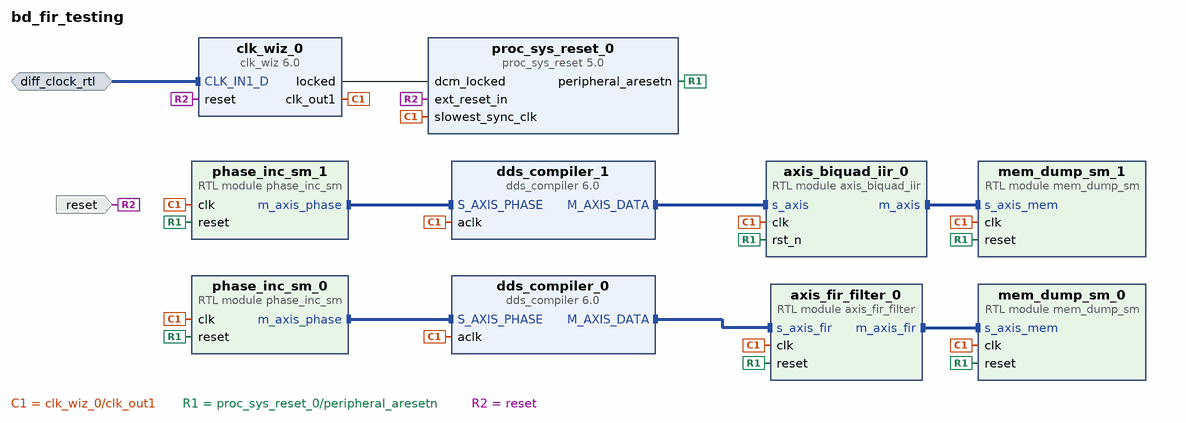
[diagram p0: block diagram of the top level]
# Vivado block design bd_fir_testing, xc7z010clg400-1, Vivado 2023.2
create_bd_design bd_fir_testing

create_bd_intf_port -mode Slave -vlnv xilinx.com:interface:diff_clock_rtl:1.0 diff_clock_rtl
set_property -dict {CONFIG.FREQ_HZ 100000000} [get_bd_intf_ports diff_clock_rtl]
create_bd_port -dir I -type rst reset
set_property -dict {CONFIG.POLARITY ACTIVE_HIGH} [get_bd_ports reset]

create_bd_cell -type ip -vlnv xilinx.com:ip:clk_wiz:6.0 clk_wiz_0
set_property -dict [list \
  CONFIG.CLKIN1_JITTER_PS 100.0 \
  CONFIG.CLKOUT1_JITTER 130.958 \
  CONFIG.CLKOUT1_PHASE_ERROR 98.575 \
  CONFIG.MMCM_CLKFBOUT_MULT_F 10.000 \
  CONFIG.MMCM_CLKIN1_PERIOD 10.000 \
  CONFIG.PRIM_SOURCE Differential_clock_capable_pin \
] [get_bd_cells clk_wiz_0]
create_bd_cell -type module -reference axis_fir_filter axis_fir_filter_0
create_bd_cell -type module -reference phase_inc_sm phase_inc_sm_0
create_bd_cell -type ip -vlnv xilinx.com:ip:dds_compiler:6.0 dds_compiler_0
set_property -dict [list \
  CONFIG.DATA_Has_TLAST Packet_Framing \
  CONFIG.Frequency_Resolution 0.2 \
  CONFIG.Has_Phase_Out false \
  CONFIG.Has_TREADY true \
  CONFIG.Latency 14 \
  CONFIG.M_DATA_Has_TUSER Not_Required \
  CONFIG.Noise_Shaping Auto \
  CONFIG.Output_Frequency1 0 \
  CONFIG.Output_Selection Sine \
  CONFIG.Output_Width 15 \
  CONFIG.PINC1 0 \
  CONFIG.Phase_Increment Streaming \
  CONFIG.Phase_Width 29 \
  CONFIG.S_PHASE_Has_TUSER Not_Required \
  CONFIG.Spurious_Free_Dynamic_Range 90 \
] [get_bd_cells dds_compiler_0]
create_bd_cell -type module -reference mem_dump_sm mem_dump_sm_0
create_bd_cell -type ip -vlnv xilinx.com:ip:proc_sys_reset:5.0 proc_sys_reset_0
set_property -dict {CONFIG.C_AUX_RESET_HIGH 0} [get_bd_cells proc_sys_reset_0]
create_bd_cell -type module -reference axis_biquad_iir axis_biquad_iir_0
create_bd_cell -type ip -vlnv xilinx.com:ip:dds_compiler:6.0 dds_compiler_1
set_property -dict [list \
  CONFIG.DATA_Has_TLAST Packet_Framing \
  CONFIG.Frequency_Resolution 0.2 \
  CONFIG.Has_Phase_Out false \
  CONFIG.Has_TREADY true \
  CONFIG.Latency 14 \
  CONFIG.M_DATA_Has_TUSER Not_Required \
  CONFIG.Noise_Shaping Auto \
  CONFIG.Output_Frequency1 0 \
  CONFIG.Output_Selection Sine \
  CONFIG.Output_Width 15 \
  CONFIG.PINC1 0 \
  CONFIG.Phase_Increment Streaming \
  CONFIG.Phase_Width 29 \
  CONFIG.S_PHASE_Has_TUSER Not_Required \
  CONFIG.Spurious_Free_Dynamic_Range 90 \
] [get_bd_cells dds_compiler_1]
create_bd_cell -type module -reference phase_inc_sm phase_inc_sm_1
create_bd_cell -type module -reference mem_dump_sm mem_dump_sm_1

# ---- connections ----

connect_bd_intf_net [get_bd_intf_pins axis_biquad_iir_0/m_axis] [get_bd_intf_pins mem_dump_sm_1/s_axis_mem]
connect_bd_intf_net [get_bd_intf_pins axis_fir_filter_0/m_axis_fir] [get_bd_intf_pins mem_dump_sm_0/s_axis_mem]
connect_bd_intf_net [get_bd_intf_pins dds_compiler_0/M_AXIS_DATA] [get_bd_intf_pins axis_fir_filter_0/s_axis_fir]
connect_bd_intf_net [get_bd_intf_pins dds_compiler_1/M_AXIS_DATA] [get_bd_intf_pins axis_biquad_iir_0/s_axis]
connect_bd_intf_net [get_bd_intf_ports diff_clock_rtl] [get_bd_intf_pins clk_wiz_0/CLK_IN1_D]
connect_bd_intf_net [get_bd_intf_pins phase_inc_sm_0/m_axis_phase] [get_bd_intf_pins dds_compiler_0/S_AXIS_PHASE]
connect_bd_intf_net [get_bd_intf_pins phase_inc_sm_1/m_axis_phase] [get_bd_intf_pins dds_compiler_1/S_AXIS_PHASE]
connect_bd_net [get_bd_pins clk_wiz_0/clk_out1] \
  [get_bd_pins phase_inc_sm_0/clk] [get_bd_pins axis_fir_filter_0/clk] [get_bd_pins dds_compiler_0/aclk] \
  [get_bd_pins mem_dump_sm_0/clk] [get_bd_pins proc_sys_reset_0/slowest_sync_clk] [get_bd_pins phase_inc_sm_1/clk] \
  [get_bd_pins axis_biquad_iir_0/clk] [get_bd_pins dds_compiler_1/aclk] [get_bd_pins mem_dump_sm_1/clk]
connect_bd_net [get_bd_pins clk_wiz_0/locked] [get_bd_pins proc_sys_reset_0/dcm_locked]
connect_bd_net [get_bd_pins proc_sys_reset_0/peripheral_aresetn] \
  [get_bd_pins phase_inc_sm_0/reset] [get_bd_pins axis_fir_filter_0/reset] [get_bd_pins mem_dump_sm_0/reset] \
  [get_bd_pins phase_inc_sm_1/reset] [get_bd_pins axis_biquad_iir_0/rst_n] [get_bd_pins mem_dump_sm_1/reset]
connect_bd_net [get_bd_ports reset] [get_bd_pins clk_wiz_0/reset] [get_bd_pins proc_sys_reset_0/ext_reset_in]

validate_bd_design
save_bd_design
